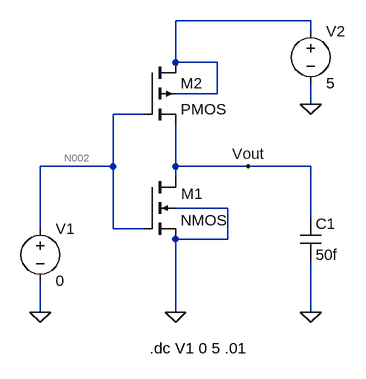
[diagram p0: schematic Inverter.asc]
Inverter.asc, the LTspice schematic file:
Version 4
SHEET 1 880 680
WIRE 480 -32 272 -32
WIRE 480 -16 480 -32
WIRE 272 32 272 -32
WIRE 336 32 272 32
WIRE 336 80 336 32
WIRE 336 80 272 80
WIRE 480 96 480 64
WIRE 224 112 176 112
WIRE 176 192 176 112
WIRE 176 192 64 192
WIRE 272 192 272 128
WIRE 384 192 272 192
WIRE 480 192 384 192
WIRE 272 208 272 192
WIRE 352 256 272 256
WIRE 480 272 480 192
WIRE 64 288 64 192
WIRE 176 288 176 192
WIRE 224 288 176 288
WIRE 352 304 352 256
WIRE 352 304 272 304
WIRE 64 416 64 368
WIRE 272 416 272 304
WIRE 480 416 480 336
FLAG 480 96 0
FLAG 64 416 0
FLAG 272 416 0
FLAG 480 416 0
FLAG 384 192 Vout
SYMBOL nmos4 224 208 R0
WINDOW 0 57 26 Left 2
WINDOW 3 56 67 Left 2
SYMATTR InstName M1
SYMATTR Value2 l=0.5u w=2u
SYMBOL pmos4 224 32 R0
SYMATTR InstName M2
SYMATTR Value2 l=0.5u w=2u
SYMBOL voltage 64 272 R0
WINDOW 123 0 0 Left 0
WINDOW 39 0 0 Left 0
SYMATTR InstName V1
SYMATTR Value 0
SYMBOL voltage 480 -32 R0
WINDOW 123 0 0 Left 0
WINDOW 39 0 0 Left 0
SYMATTR InstName V2
SYMATTR Value 5
SYMBOL cap 464 272 R0
SYMATTR InstName C1
SYMATTR Value 50f
TEXT 232 472 Left 2 !.dc V1 0 5 .01

The netlist it stands for:
* Inverter.asc
M1 Vout N002 0 0 NMOS l=0.5u w=2u
M2 N001 N002 Vout N001 PMOS l=0.5u w=2u
V1 N002 0 0
V2 N001 0 5
C1 Vout 0 50f
.model NMOS NMOS
.model PMOS PMOS
.lib standard.mos
.dc V1 0 5 .01
.backanno
.end

* Results of the author's LTspice run, read from the files saved beside the schematic
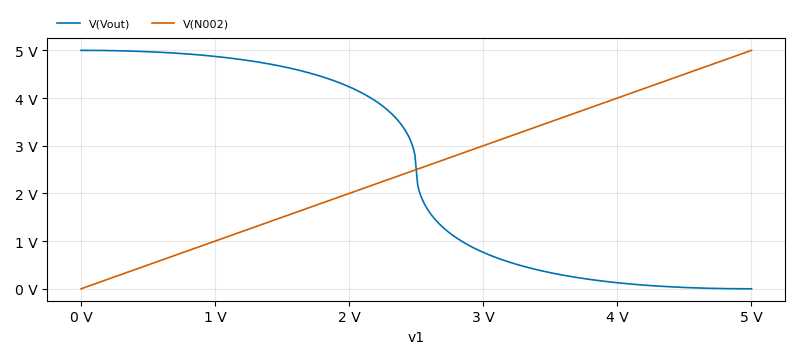
[diagram p1: DC transfer characteristic of Inverter.asc, plotted from the saved traces]
* DC transfer characteristic, 1 run:
*   V(Vout): 5 V at v1=0 V, 24.98 nV at v1=5 V, min 24.98 nV, max 5 V
*   V(N002): 0 V at v1=0 V, 5 V at v1=5 V, min 0 V, max 5 V